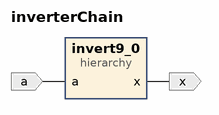
[diagram p0: block diagram of the top level]
# Vivado block design inverterChain, xc7z020clg484-1, Vivado 2024.2
create_bd_design inverterChain

create_bd_port -dir I a
create_bd_port -dir O x

create_bd_cell -type hier invert9_0

# ---- hierarchy /invert9_0 ----
current_bd_instance /invert9_0
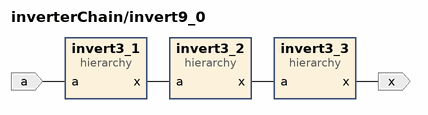
[diagram p1: block diagram inside /invert9_0]
create_bd_pin -dir O x
create_bd_pin -dir I a

create_bd_cell -type hier invert3_1
create_bd_cell -type hier invert3_3
create_bd_cell -type hier invert3_2

# ---- hierarchy /invert9_0/invert3_1 ----
current_bd_instance /invert9_0/invert3_1
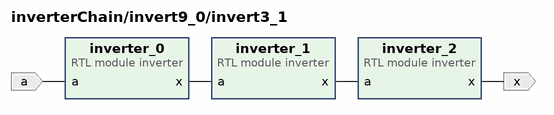
[diagram p2: block diagram inside /invert9_0/invert3_1]
create_bd_pin -dir I a
create_bd_pin -dir O x

create_bd_cell -type module -reference inverter inverter_0
create_bd_cell -type module -reference inverter inverter_1
create_bd_cell -type module -reference inverter inverter_2

# ---- hierarchy /invert9_0/invert3_3 ----
current_bd_instance /invert9_0/invert3_3
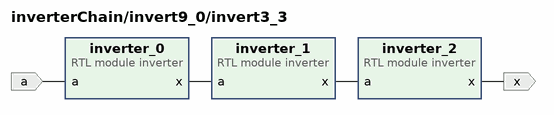
[diagram p3: block diagram inside /invert9_0/invert3_3]
create_bd_pin -dir I a
create_bd_pin -dir O x

create_bd_cell -type module -reference inverter inverter_0
create_bd_cell -type module -reference inverter inverter_1
create_bd_cell -type module -reference inverter inverter_2

# ---- hierarchy /invert9_0/invert3_2 ----
current_bd_instance /invert9_0/invert3_2
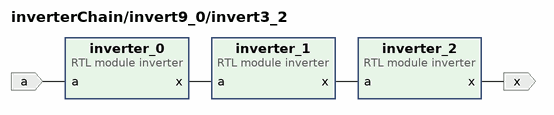
[diagram p4: block diagram inside /invert9_0/invert3_2]
create_bd_pin -dir I a
create_bd_pin -dir O x

create_bd_cell -type module -reference inverter inverter_0
create_bd_cell -type module -reference inverter inverter_1
create_bd_cell -type module -reference inverter inverter_2

# ---- connections ----

current_bd_instance /invert9_0
connect_bd_net [get_bd_pins a] [get_bd_pins invert3_1/a]
connect_bd_net [get_bd_pins invert3_1/x] [get_bd_pins invert3_2/a]
connect_bd_net [get_bd_pins invert3_2/x] [get_bd_pins invert3_3/a]
connect_bd_net [get_bd_pins invert3_3/x] [get_bd_pins x]

current_bd_instance /invert9_0/invert3_1
connect_bd_net [get_bd_pins a] [get_bd_pins inverter_0/a]
connect_bd_net [get_bd_pins inverter_0/x] [get_bd_pins inverter_1/a]
connect_bd_net [get_bd_pins inverter_1/x] [get_bd_pins inverter_2/a]
connect_bd_net [get_bd_pins inverter_2/x] [get_bd_pins x]

current_bd_instance /invert9_0/invert3_3
connect_bd_net [get_bd_pins a] [get_bd_pins inverter_0/a]
connect_bd_net [get_bd_pins inverter_0/x] [get_bd_pins inverter_1/a]
connect_bd_net [get_bd_pins inverter_1/x] [get_bd_pins inverter_2/a]
connect_bd_net [get_bd_pins inverter_2/x] [get_bd_pins x]

current_bd_instance /invert9_0/invert3_2
connect_bd_net [get_bd_pins a] [get_bd_pins inverter_0/a]
connect_bd_net [get_bd_pins inverter_0/x] [get_bd_pins inverter_1/a]
connect_bd_net [get_bd_pins inverter_1/x] [get_bd_pins inverter_2/a]
connect_bd_net [get_bd_pins inverter_2/x] [get_bd_pins x]

current_bd_instance /
connect_bd_net [get_bd_ports a] [get_bd_pins invert9_0/a]
connect_bd_net [get_bd_pins invert9_0/x] [get_bd_ports x]

validate_bd_design
save_bd_design
